# EAGLE schematic v5-Relay-Section-temp (EAGLE 7.5.0)
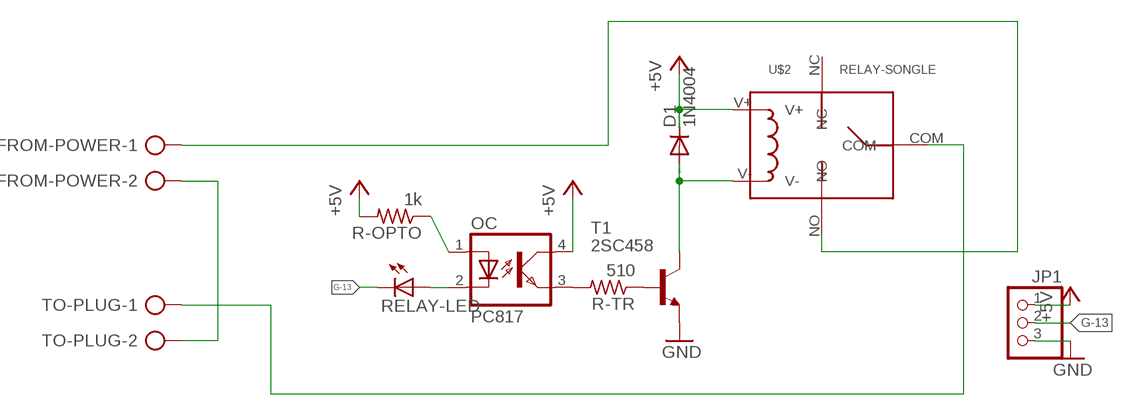
[diagram p0: schematic, sheet 1]

## Parts
D1  1N4004  [DO41-10]
FROM-POWER  AK300/2  [AK300/2]
JP1  PINHD-1X3  [1X03]
OC  PC817  [DIL04]
R-OPTO  1k  R-US_0207/7  [0207/7]
R-TR  510  R-US_0207/7  [0207/7]
RELAY-LED  LED3MM  [LED3MM]
T1  2SC458  [TO92-ECB]
TO-PLUG  AK300/2  [AK300/2]
U$2  RELAY-SONGLE  [RELAY-SONGLE]

## Nets
+5V: D1.C JP1.1 OC.4(COL) R-OPTO.2 U$2.V+
G-13: JP1.2 RELAY-LED.K(C)
GND: JP1.3 T1.E
N$1: OC.3(EMIT) R-TR.2
N$2: R-TR.1 T1.B
N$3: FROM-POWER.2 TO-PLUG.2
N$4: FROM-POWER.1 U$2.NO
N$5: TO-PLUG.1 U$2.COM
N$6: OC.2(C) RELAY-LED.A
N$13: OC.1(A) R-OPTO.1
N$18: D1.A T1.C U$2.V-
Unconnected: U$2.NC

## Library data of the parts
D1 = diode:1N4004: DIODE general purpose rectifier, 1 A
FROM-POWER TO-PLUG = con-ptr500:AK300/2: CONNECTOR; OC_FARNELL: unknown; OC_NEWARK: unknown
JP1 = pinhead:PINHD-1X3: PIN HEADER
OC = optocoupler:PC817: SHARP OPTO COUPLER; MPN: PC817X4J000F; OC_FARNELL: 9707727; OC_NEWARK: 97K7059
R-OPTO R-TR = rcl:R-US_: RESISTOR, American symbol
RELAY-LED = led:LED: LED OSRAM: - CHIPLED LG R971, LG N971, LY N971, LG Q971, LY Q971, LO R971, LY R971 LH N974, LH R974 LS Q976, LO Q976, LY Q976 LO Q996 - Hyper CHIPLED LW Q18S LB Q993, LB Q99A, LB R99A - SideLED LS A670, LO A670, LY A670, LG A670, LP A670 LB A673, LV A673, LT A673, LW A673 LH A674 LY A675 LS A676, LA A676, LO A676, LY A676, LW A676 LS A679, LY A679, LG A679 - Hyper Micro SIDELED® LS Y876, LA Y876, LO Y876, LY Y876 LT Y87S - SmartLED LW L88C, LW L88S LB L89C, LB L89S, LG L890 LS L89K, LO L89K, LY L89K LS L896, LA L896, LO L896, LY L896 - TOPLED LS T670, LO T670, LY T670, LG T670, LP T670 LSG T670, LSP T670, LSY T670, LOP T670, LYG T670 LG T671, LOG T671, LSG T671 LB T673, LV T673, LT T673, LW T673 LH T674 LS T676, LA T676, LO T676, LY T676, LB T676, LH T676, LSB T676, LW T676 LB T67C, LV T67C, LT T67C, LS T67K, LO T67K, LY T67K, LW E67C LS E67B, LA E67B, LO E67B, LY E67B, LB E67C, LV E67C, LT E67C LW T67C LS T679, LY T679, LG T679 LS T770, LO T770, LY T770, LG T770, LP T770 LB T773, LV T773, LT T773, LW T773 LH T774 LS E675, LA E675, LY E675, LS T675 LS T776, LA T776, LO T776, LY T776, LB T776 LHGB T686 LT T68C, LB T68C - Hyper Mini TOPLED® LB M676 - Mini TOPLED Santana® LG M470 LS M47K, LO M47K, LY M47K Source: http://www.osram.convergy.de LUXEON: - LUMILED® LXK2-PW12-R00, LXK2-PW12-S00, LXK2-PW14-U00, LXK2-PW14-V00 LXK2-PM12-R00, LXK2-PM12-S00, LXK2-PM14-U00 LXK2-PE12-Q00, LXK2-PE12-R00, LXK2-PE12-S00, LXK2-PE14-T00, LXK2-PE14-U00 LXK2-PB12-K00, LXK2-PB12-L00, LXK2-PB12-M00, LXK2-PB14-N00, LXK2-PB14-P00, LXK2-PB14-Q00 LXK2-PR12-L00, LXK2-PR12-M00, LXK2-PR14-Q00, LXK2-PR14-R00 LXK2-PD12-Q00, LXK2-PD12-R00, LXK2-PD12-S00 LXK2-PH12-R00, LXK2-PH12-S00 LXK2-PL12-P00, LXK2-PL12-Q00, LXK2-PL12-R00 Source: www.luxeon.com KINGBRIGHT: KA-3528ASYC Source: www.kingbright.com
T1 = transistor:2SC458: NPN Silicon Epitaxial Planar Transistor Source: SEMTECH ELECTRONICS LTD. ... 2SC458 1.pdf
U$2 = Seeed-OPL-Relay:RELAY-SONGLE